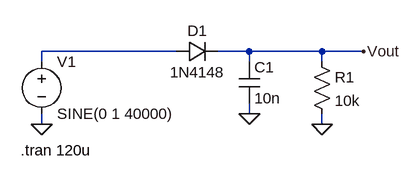
[diagram p0: schematic Envelope Detector.asc]
Envelope Detector.asc, the LTspice schematic file:
Version 4.1
SHEET 1 880 680
WIRE 144 48 -64 48
WIRE 256 48 208 48
WIRE 368 48 256 48
WIRE 432 48 368 48
WIRE -64 64 -64 48
WIRE 256 64 256 48
WIRE 368 64 368 48
WIRE 256 144 256 128
WIRE -64 160 -64 144
WIRE 368 160 368 144
FLAG 256 144 0
FLAG 368 160 0
FLAG 432 48 Vout
FLAG -64 160 0
SYMBOL voltage -64 48 R0
WINDOW 123 0 0 Left 0
WINDOW 39 0 0 Left 0
SYMATTR InstName V1
SYMATTR Value SINE(0 1 40000)
SYMBOL diode 144 64 R270
WINDOW 0 32 32 VTop 2
WINDOW 3 0 32 VBottom 2
SYMATTR InstName D1
SYMATTR Value 1N4148
SYMBOL cap 240 64 R0
SYMATTR InstName C1
SYMATTR Value 10n
SYMBOL res 352 48 R0
SYMATTR InstName R1
SYMATTR Value 10k
TEXT -96 200 Left 2 !.tran 120u

The netlist it stands for:
* Envelope Detector.asc
V1 N001 0 SINE(0 1 40000)
D1 N001 Vout 1N4148
C1 Vout 0 10n
R1 Vout 0 10k
.model D D
.lib standard.dio
.tran 120u
.backanno
.end